# EAGLE design amiga2gameport (EAGLE 4.16)
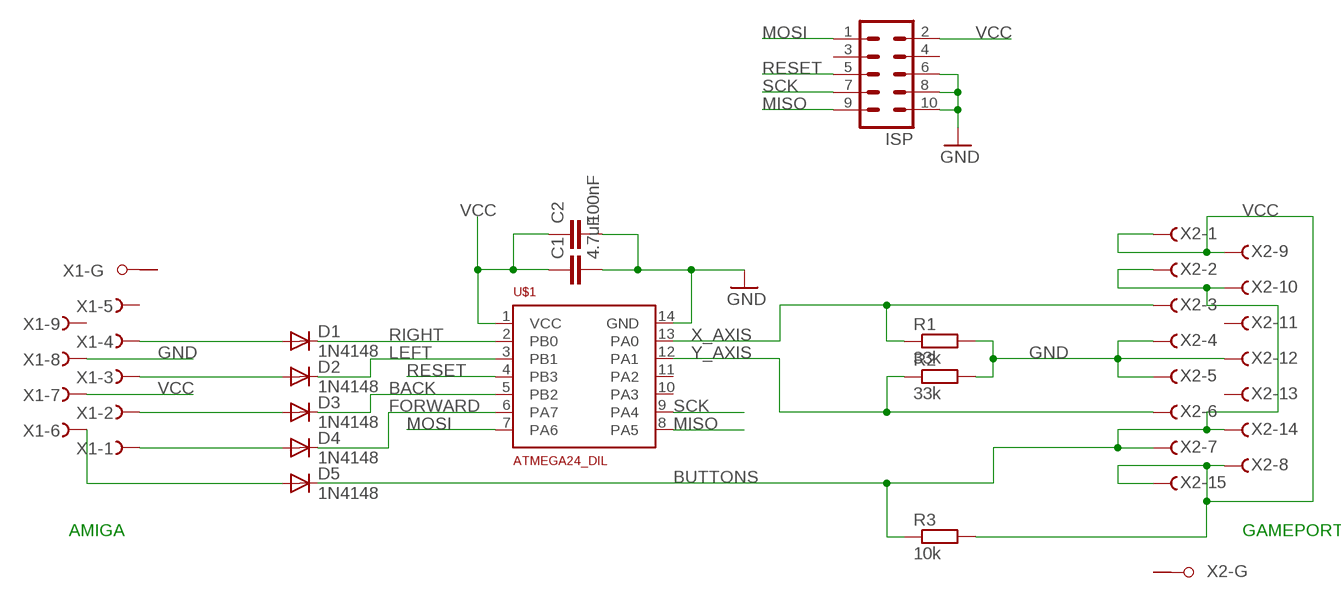
[diagram p0: schematic, sheet 1]

## Parts
C1  4.7uF  C-EU050-024X044  [C050-024X044]
C2  100nF  C-EU050-024X044  [C050-024X044]
D1  1N4148  [DO35-10]
D2  1N4148  [DO35-10]
D3  1N4148  [DO35-10]
D4  1N4148  [DO35-10]
D5  1N4148  [DO35-10]
ISP  MA05-2  [MA05-2]
R1  33k  R-EU_0309/10  [0309/10]
R2  33k  R-EU_0309/10  [0309/10]
R3  10k  R-EU_0309/10  [0309/10]
U$1  ATMEGA24_DIL  [DIL14]
X1  F09HPS  [F09HP]
X2  F15HPS  [F15HP]

## Nets
BACK: D3.C U$1.5(PB2)
BUTTONS: D5.C R3.1 X2.2(-2:F) X2.7(-7:F) X2.10(-10:F) X2.14(-14:F)
FORWARD: D4.C U$1.6(PA7)
GND: C1.2 C2.2 ISP.6 ISP.8 ISP.10 R1.2 R2.2 U$1.14(GND) X1.8(-8:F) X2.4(-4:F) X2.5(-5:F) X2.12(-12:F)
LEFT: D2.C U$1.3(PB1)
MISO: ISP.9 U$1.8(PA5)
MOSI: ISP.1 U$1.7(PA6)
N$1: D1.A X1.4(-4:F)
N$4: D3.A X1.2(-2:F)
N$7: D2.A X1.3(-3:F)
N$8: D4.A X1.1(-1:F)
N$10: D5.A X1.6(-6:F)
RESET: ISP.5 U$1.4(PB3)
RIGHT: D1.C U$1.2(PB0)
SCK: ISP.7 U$1.9(PA4)
VCC: C1.1 C2.1 ISP.2 R3.2 U$1.1(VCC) X1.7(-7:F) X2.1(-1:F) X2.8(-8:F) X2.9(-9:F) X2.15(-15:F)
X_AXIS: R1.1 U$1.13(PA0) X2.3(-3:F)
Y_AXIS: R2.1 U$1.12(PA1) X2.6(-6:F)
Unconnected: ISP.3 ISP.4 U$1.10(PA3) U$1.11(PA2) X1.5(-5:F) X1.9(-9:F) X1.G1(-G:G1) X1.G2(-G:G2) X2.11(-11:F) X2.13(-13:F) X2.G1(-G:G1) X2.G2(-G:G2)

## Notes on the sheet
- AMIGA | GAMEPORT

## Library data of the parts
C1 C2 = rcl:C-EU: CAPACITOR, European symbol
D1-D5 = diode:1N4148: DIODE high speed (Philips)
ISP = con-lstb:MA05-2: PIN HEADER
R1-R3 = rcl:R-EU_: RESISTOR, European symbol
U$1 = atmel:ATMEGA24_DIL
X1 = con-subd:F09HPS: SUB-D
X2 = con-subd:F15HPS: SUB-D

## Board
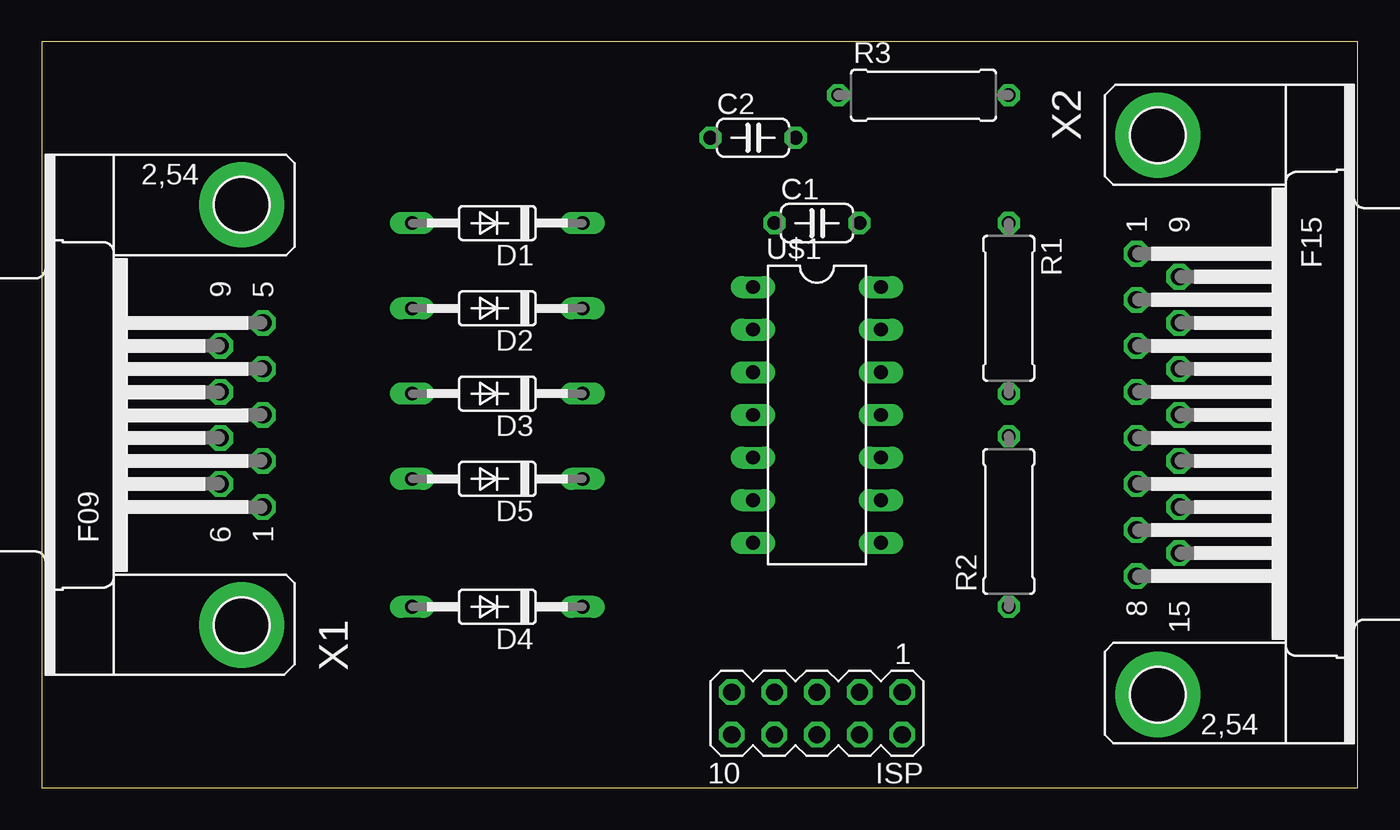
[diagram p1: board, top side]
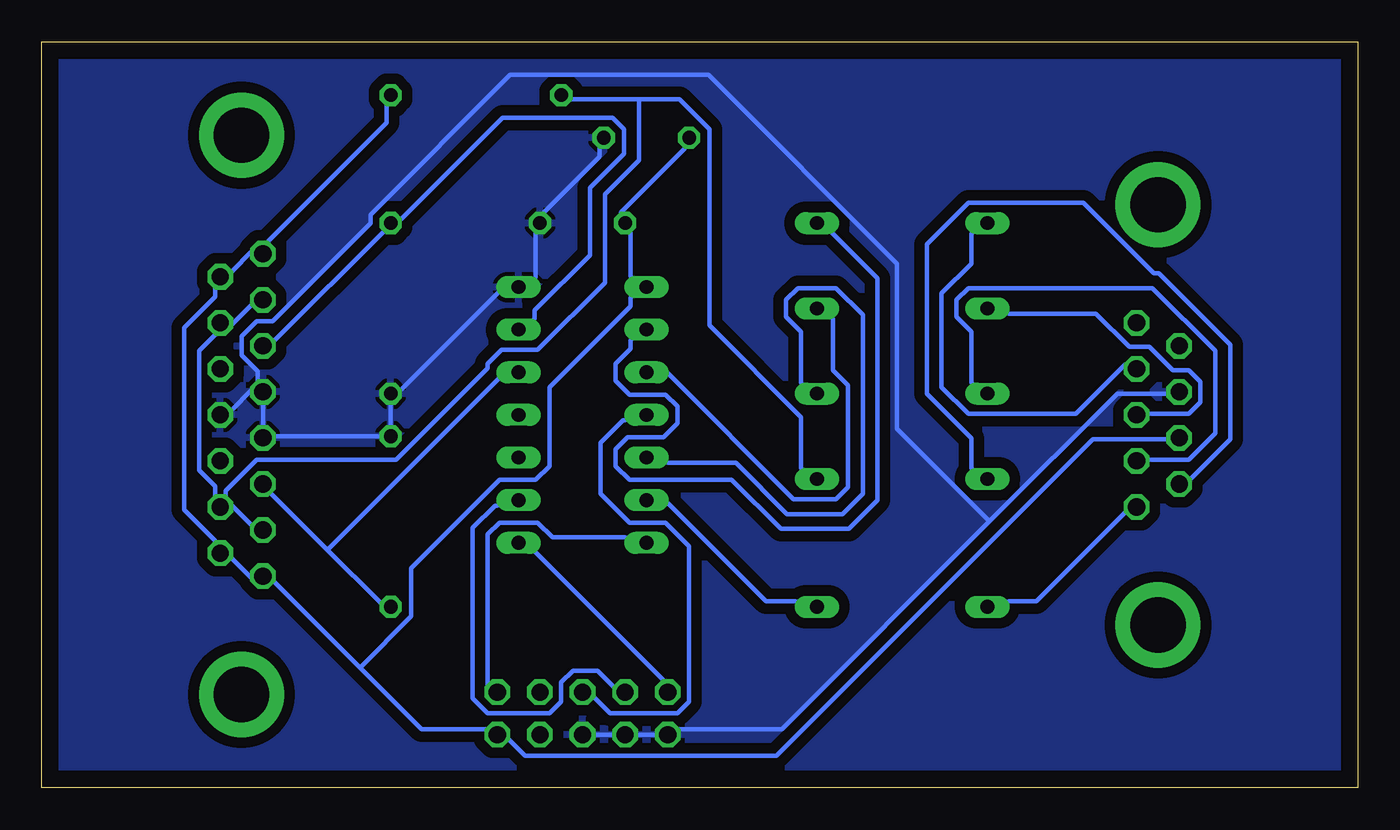
[diagram p2: board, bottom side, seen from below]

Size 78.41 x 44.44 mm. Coordinates in mm from the lower left corner, seen from the top.
Outline: 0,0 78.41,0 78.41,44.44 0,44.44 0,0
Copper layers (1*16): Top 0.035mm / dielectric 1.5mm / Bottom 0.035mm
Design rules "default": minimum track width 10mil, minimum drill 24mil, track to track 25mil, track to pad 15mil, pad to pad 15mil, via to via 10mil, smd to smd 8mil, copper to edge 40mil, drill to drill 8mil, minimum pad ring 10mil, minimum via ring 8mil, stop-mask expansion 4mil, vias tented up to drill 0mil, thermal gap 10mil

### Footprints (pad centres in the part's own frame; a part is rotated, then mirrored left to right if it is on the bottom)
C050-024X044 = drill 0.813 octagon: 1 -2.54,0; 2 2.54,0
DO35-10 = drill 0.813 long: A 5.08,0; C -5.08,0
MA05-2 = drill 1.016 octagon: 1 -5.08,-1.27; 2 -5.08,1.27; 3 -2.54,-1.27; 4 -2.54,1.27; 5 0,-1.27; 6 0,1.27; 7 2.54,-1.27; 8 2.54,1.27; 9 5.08,-1.27; 10 5.08,1.27
0309/10 = drill 0.813 octagon: 1 -5.08,0; 2 5.08,0
DIL14 = drill 0.813 long: 1 -7.62,-3.81; 2 -5.08,-3.81; 3 -2.54,-3.81; 4 0,-3.81; 5 2.54,-3.81; 6 5.08,-3.81; 7 7.62,-3.81; 8 7.62,3.81; 9 5.08,3.81; 10 2.54,3.81; 11 0,3.81; 12 -2.54,3.81; 13 -5.08,3.81; 14 -7.62,3.81
F09HP = drill 1.016 octagon: 1 -5.486,-1.27; 2 -2.743,-1.27; 3 0,-1.27; 4 2.743,-1.27; 5 5.486,-1.27; 6 -4.115,1.27; 7 -1.372,1.27; 8 1.372,1.27; 9 4.115,1.27 | drill 3.302 pad 5.08 round: G1 -12.522,0; G2 12.522,0
F15HP = drill 1.016 octagon: 1 -9.601,-1.27; 2 -6.858,-1.27; 3 -4.115,-1.27; 4 -1.372,-1.27; 5 1.372,-1.27; 6 4.115,-1.27; 7 6.858,-1.27; 8 9.601,-1.27; 9 -8.23,1.27; 10 -5.486,1.27; 11 -2.743,1.27; 12 0,1.27; 13 2.743,1.27; 14 5.486,1.27; 15 8.23,1.27 | drill 3.302 pad 5.08 round: G1 -16.662,0; G2 16.662,0

### Placement (x,y rotation side)
C1  46.19,33.65 0 top
C2  42.38,38.73 0 top
D1  27.14,33.65 180 top
D2  27.14,28.57 180 top
D3  27.14,23.49 180 top
D4  27.14,10.79 180 top
D5  27.14,18.41 180 top
ISP  46.19,4.44 180 top
R1  57.62,28.57 270 top
R2  57.62,15.87 90 top
R3  52.54,41.27 0 top
U$1  46.19,22.22 270 top
X1  11.9,22.22 90 top
X2  66.51,22.22 270 top

### Tracks (layer width: path | path; a pad name or v marks a point on that pad's centre or on a via)
BACK
  Bottom 0.254: D3.C 33.17,24.12 33.17,27.17 34.06,28.06 34.06,29.08 33.36,29.78 31.08,29.78 29.49,28.19 29.49,17.52 30.7,16.32 34,16.32 37.05,19.36 41.11,19.36 U$1.5
BUTTONS
  Bottom 0.254: X2.7 65.94,15.68 67.08,16.82 X2.14 | X2.2 65.94,28.76 67.08,27.62 X2.10 68.1,26.98 69.05,26.03 69.05,18.92 68.1,17.97 68.1,17.46 X2.14 | 42.82,41.02 46.82,41.02 R3.1 | 42.82,41.02 40.41,41.02 38.63,39.24 38.63,27.55 33.17,22.09 33.17,19.05 D5.C | X2.14 67.46,17.46 67.46,17.71 65.62,19.55 57.3,19.55 51.84,25.01 51.84,25.27 51.02,26.09 48.86,26.09 44.86,30.09 44.86,35.36 42.82,37.4 42.82,41.02
FORWARD
  Bottom 0.254: D4.C 33.49,11.11 35.27,11.11 41.11,16.95 U$1.6
GND
  Bottom 0.254: X2.4 X2.5 64.54,20.95 R2.2 R1.2 56.98,23.74 51.21,29.52 U$1.14 48.98,30.41 48.98,33.02 C1.2 48.48,34.29 45.17,37.59 45.17,38.09 C2.2 | X2.12 67.08,22.54 65.94,23.68 X2.4 | ISP.6 ISP.8 ISP.10 40.41,3.49 34.32,3.49 21.93,15.87 | 21.93,15.87 14.31,23.49 11.33,23.49 X1.8 | X2.4 65.56,24.32 65.56,24.82 66.51,25.78 66.51,26.92 65.62,27.81 64.67,27.81 58.83,33.65 58.83,34.16 50.51,42.48 38.7,42.48 27.46,31.24 27.46,21.39 21.93,15.87
  pour Bottom: 0.47,43.81 0.47,0.63 77.94,0.63 77.94,43.81
LEFT
  Bottom 0.254: D2.C 31.27,27.94 31.27,24.89 30.38,24 30.38,17.9 31.08,17.2 33.62,17.2 41.11,24.7 U$1.3
MISO
  Bottom 0.254: U$1.8 48.98,14.03 41.36,6.41 ISP.9
MOSI
  Bottom 0.254: U$1.7 43.65,14.92 47.97,14.92 48.86,15.81 51.14,15.81 51.84,15.11 51.84,6.16 ISP.1
N$1
  Bottom 0.254: D1.A 23.01,33.02 23.01,31.24 24.79,29.46 24.79,23.87 23.2,22.28 16.79,22.28 13.87,25.2 X1.4
N$4
  Bottom 0.254: D3.A 23.01,24.12 23.01,27.17 23.9,28.06 23.9,29.08 23.2,29.78 12.22,29.78 8.47,26.03 8.47,21.14 10.06,19.55 12.47,19.55 X1.2
N$7
  Bottom 0.254: D2.A 20.79,28.25 15.58,28.25 13.62,26.28 12.41,26.28 11.01,24.89 10.06,24.89 9.36,24.19 9.36,22.98 10.06,22.28 12.47,22.28 X1.3
N$8
  Bottom 0.254: D4.A 20.79,11.11 19.14,11.11 13.87,16.38 X1.1
N$10
  Bottom 0.254: D5.A 23.01,19.05 23.01,20.82 25.68,23.49 25.68,32.38 23.2,34.86 16.34,34.86 12.15,30.67 11.84,30.67 7.58,26.41 7.58,20.76 9.93,18.41 X1.6
RESET
  Bottom 0.254: U$1.4 43.65,21.9 43.78,21.9 45.11,20.57 45.11,17.52 43.4,15.81 41.24,15.81 39.84,14.41 39.84,5.14 40.54,4.44 44.54,4.44 45.49,5.39 ISP.5
RIGHT
  Bottom 0.254: U$1.2 43.33,26.66 43.33,26.16 44.22,25.27 44.22,24.25 43.4,23.43 41.24,23.43 40.54,22.73 40.54,21.71 41.36,20.89 43.52,20.89 44.22,20.19 44.22,19.17 43.4,18.35 37.3,18.35 34.38,15.43 30.31,15.43 28.6,17.14 28.6,30.35 31.27,33.02 D1.C
SCK
  Bottom 0.254: U$1.9 51.27,16.82 51.4,16.82 52.73,15.49 52.73,5.33 51.84,4.44 48.16,4.44 47.46,5.14 47.46,6.28 46.76,6.98 45.3,6.98 44.35,6.03 ISP.7
VCC
  Bottom 0.254: R3.2 57.87,40.63 57.87,39.62 64.92,32.57 X2.1 65.94,31.94 67.08,30.79 X2.9 68.1,29.71 68.1,29.27 69.94,27.43 69.94,16.57 68.1,14.73 X2.15 67.08,13.65 65.94,12.5 X2.8 64.54,12.25 59.46,7.17 | C2.1 40.09,38.09 43.9,34.29 C1.1 43.33,33.08 43.33,30.48 U$1.1 43.33,29.2 43.33,28.7 48.16,23.87 48.16,19.17 48.98,18.35 51.14,18.35 56.41,13.08 56.41,10.22 59.46,7.17 | 59.46,7.17 55.78,3.49 51.97,3.49 ISP.2 50.57,2.85 49.62,1.9 34.63,1.9 15.77,20.76 11.33,20.76 X1.7
X_AXIS
  Bottom 0.254: U$1.13 49.05,27.94 49.05,28.44 45.75,31.75 45.75,35.75 43.71,37.78 43.71,39.24 44.41,39.94 50.95,39.94 56.98,33.9 R1.1 58,33.2 64.54,26.66 X2.3
Y_AXIS
  Bottom 0.254: 61.4,14.19 64.8,17.58 X2.6 | 61.4,14.19 58.25,11.04 R2.1 | U$1.12 51.21,24.38 61.37,14.22 61.4,14.19